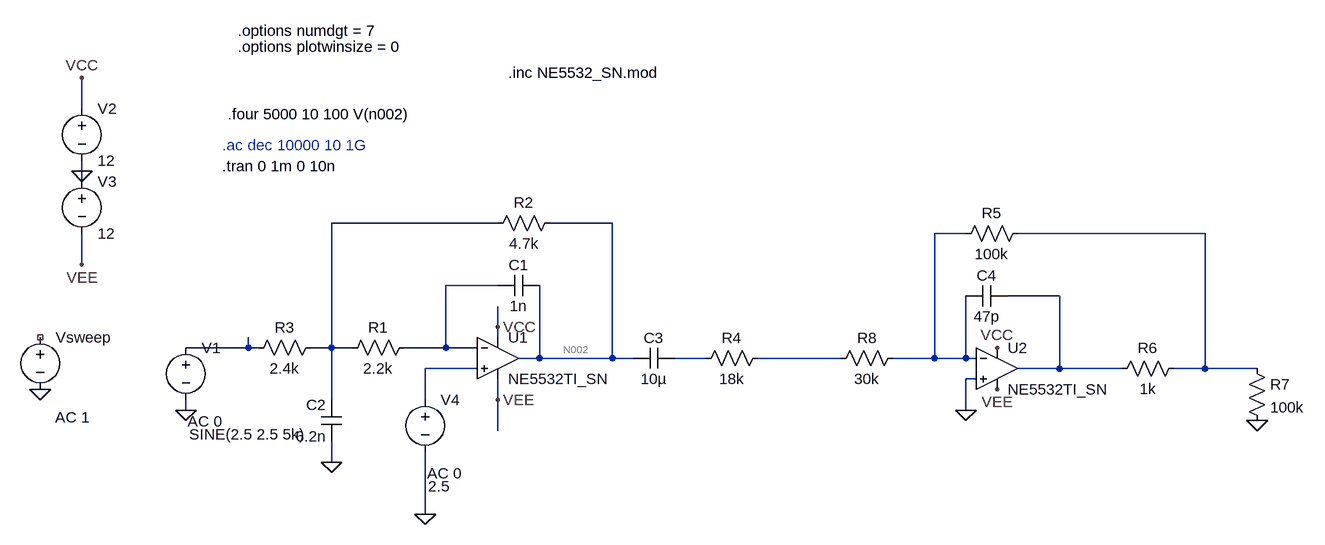
[diagram p0: schematic DAC_output_vcom.asc]
DAC_output_vcom.asc, the LTspice schematic file:
Version 4
SHEET 1 1500 680
WIRE -384 -240 -384 -288
WIRE -384 -144 -384 -160
WIRE -384 -128 -384 -144
WIRE 256 -64 0 -64
WIRE 432 -64 336 -64
WIRE 976 -48 928 -48
WIRE 1344 -48 1056 -48
WIRE -384 0 -384 -48
WIRE 256 32 176 32
WIRE 1120 48 1040 48
WIRE 256 96 256 64
WIRE 256 112 256 96
WIRE -128 128 -128 112
WIRE -128 128 -224 128
WIRE -112 128 -128 128
WIRE 0 128 0 -64
WIRE 0 128 -32 128
WIRE 32 128 0 128
WIRE 176 128 176 32
WIRE 176 128 112 128
WIRE 224 128 176 128
WIRE 320 144 320 32
WIRE 320 144 288 144
WIRE 432 144 432 -64
WIRE 432 144 320 144
WIRE 464 144 432 144
WIRE 576 144 528 144
WIRE 784 144 656 144
WIRE 928 144 928 -48
WIRE 928 144 864 144
WIRE 976 144 976 48
WIRE 976 144 928 144
WIRE 992 144 976 144
WIRE 224 160 144 160
WIRE 1120 160 1120 48
WIRE 1120 160 1056 160
WIRE 1216 160 1120 160
WIRE 1344 160 1344 -48
WIRE 1344 160 1296 160
WIRE 1424 160 1344 160
WIRE 992 176 976 176
WIRE 0 208 0 128
WIRE 144 208 144 160
WIRE 256 208 256 176
WIRE -224 224 -224 208
WIRE 976 224 976 176
WIRE 256 256 256 208
WIRE 0 304 0 272
WIRE 144 384 144 288
FLAG -384 -144 0
FLAG -384 -288 VCC
FLAG -384 0 VEE
FLAG 256 96 VCC
FLAG 256 208 VEE
FLAG -448 192 0
FLAG -224 224 0
FLAG 0 304 0
FLAG 144 384 0
FLAG 1424 240 0
FLAG 976 224 0
FLAG 1024 128 VCC
FLAG 1024 192 VEE
SYMBOL Opamps\\opamp2 256 80 R0
SYMATTR InstName U1
SYMATTR Value NE5532TI_SN
SYMBOL voltage -384 -256 R0
WINDOW 123 0 0 Left 0
WINDOW 39 0 0 Left 0
SYMATTR InstName V2
SYMATTR Value 12
SYMBOL voltage -384 -144 R0
WINDOW 123 0 0 Left 0
WINDOW 39 0 0 Left 0
SYMATTR InstName V3
SYMATTR Value 12
SYMBOL res 128 112 R90
WINDOW 0 0 56 VBottom 2
WINDOW 3 32 56 VTop 2
SYMATTR InstName R1
SYMATTR Value 2.2k
SYMBOL res 352 -80 R90
WINDOW 0 0 56 VBottom 2
WINDOW 3 32 56 VTop 2
SYMATTR InstName R2
SYMATTR Value 4.7k
SYMBOL voltage -448 96 R0
WINDOW 3 24 152 Left 2
WINDOW 123 23 139 Left 2
WINDOW 39 0 0 Left 0
SYMATTR Value ""
SYMATTR Value2 AC 1
SYMATTR InstName Vsweep
SYMBOL cap 320 16 R90
WINDOW 0 0 32 VBottom 2
WINDOW 3 32 32 VTop 2
SYMATTR InstName C1
SYMATTR Value 1n
SYMBOL voltage -224 112 R0
WINDOW 3 5 149 Left 2
WINDOW 123 3 129 Left 2
WINDOW 39 0 0 Left 0
SYMATTR Value SINE(2.5 2.5 5k)
SYMATTR Value2 AC 0
SYMATTR InstName V1
SYMBOL res -16 112 R90
WINDOW 0 0 56 VBottom 2
WINDOW 3 32 56 VTop 2
SYMATTR InstName R3
SYMATTR Value 2.4k
SYMBOL cap 16 272 R180
WINDOW 0 24 56 Left 2
WINDOW 3 24 8 Left 2
SYMATTR InstName C2
SYMATTR Value 6.2n
SYMBOL cap 528 128 R90
WINDOW 0 0 32 VBottom 2
WINDOW 3 32 32 VTop 2
SYMATTR InstName C3
SYMATTR Value 10µ
SYMBOL voltage 144 192 R0
WINDOW 3 5 149 Left 2
WINDOW 123 3 129 Left 2
WINDOW 39 0 0 Left 0
SYMATTR Value 2.5
SYMATTR Value2 AC 0
SYMATTR InstName V4
SYMBOL Opamps\\opamp2 1024 96 R0
SYMATTR InstName U2
SYMATTR Value NE5532TI_SN
SYMBOL res 672 128 R90
WINDOW 0 0 56 VBottom 2
WINDOW 3 32 56 VTop 2
SYMATTR InstName R4
SYMATTR Value 18k
SYMBOL cap 1040 32 R90
WINDOW 0 0 32 VBottom 2
WINDOW 3 32 32 VTop 2
SYMATTR InstName C4
SYMATTR Value 47p
SYMBOL res 1072 -64 R90
WINDOW 0 0 56 VBottom 2
WINDOW 3 32 56 VTop 2
SYMATTR InstName R5
SYMATTR Value 100k
SYMBOL res 1312 144 R90
WINDOW 0 0 56 VBottom 2
WINDOW 3 32 56 VTop 2
SYMATTR InstName R6
SYMATTR Value 1k
SYMBOL res 1408 144 R0
SYMATTR InstName R7
SYMATTR Value 100k
SYMBOL res 880 128 R90
WINDOW 0 0 56 VBottom 2
WINDOW 3 32 56 VTop 2
SYMATTR InstName R8
SYMATTR Value 30k
TEXT 272 -296 Left 2 !.inc NE5532_SN.mod
TEXT -168 -152 Left 2 !.tran 0 1m 0 10n
TEXT -168 -184 Left 2 ;.ac dec 10000 10 1G
TEXT -160 -232 Left 2 !.four 5000 10 100 V(n002)
TEXT -144 -360 Left 2 !.options numdgt = 7
TEXT -144 -336 Left 2 !.options plotwinsize = 0

The netlist it stands for:
* DAC_output_vcom.asc
XU1 N010 N005 VCC VEE N002 NE5532TI_SN  ; pins In+ In- V+ V- OUT
V2 VCC 0 12
V3 0 VEE 12
R1 N005 N001 2.2k
R2 N002 N001 4.7k
Vsweep NC_01 0 AC 1
C1 N002 N005 1n
V1 N007 0 SINE(2.5 2.5 5k) AC 0
R3 N001 N007 2.4k
C2 0 N001 6.2n
C3 N008 N002 10µ
V4 N010 0 2.5 AC 0
XU2 0 N003 VCC VEE N006 NE5532TI_SN  ; pins In+ In- V+ V- OUT
R4 N009 N008 18k
C4 N006 N003 47p
R5 N004 N003 100k
R6 N004 N006 1k
R7 N004 0 100k
R8 N003 N009 30k
.inc NE5532_SN.mod
.tran 0 1m 0 10n
* .ac dec 10000 10 1G
.four 5000 10 100 V(n002)
.options numdgt = 7
.options plotwinsize = 0
.backanno
.end